# EAGLE design VU Meter 1inchx3inches V1.0 (EAGLE 7.1.0)
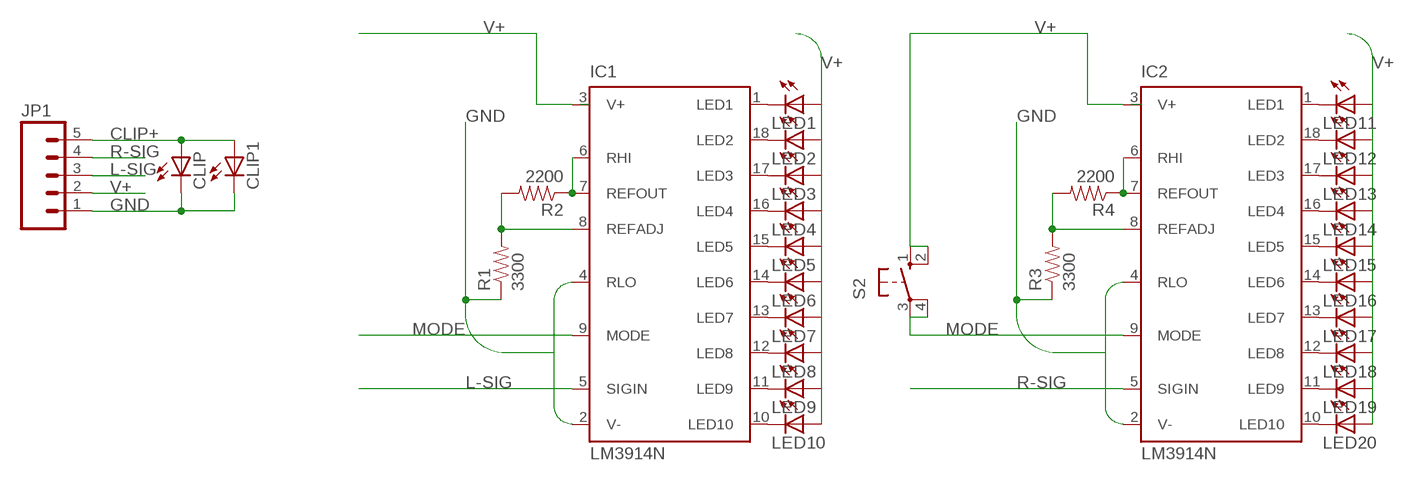
[diagram p0: schematic, sheet 1]

## Parts
CLIP  LED5MM  [LED5MM]
CLIP1  LED5MM  [LED5MM]
IC1  LM3914N  [DIL18]
IC2  LM3914N  [DIL18]
JP1  M05SMD2  [1X05-1MM-RA]
LED1  LED5MM  [LED5MM]
LED2  LED5MM  [LED5MM]
LED3  LED5MM  [LED5MM]
LED4  LED5MM  [LED5MM]
LED5  LED5MM  [LED5MM]
LED6  LED5MM  [LED5MM]
LED7  LED5MM  [LED5MM]
LED8  LED5MM  [LED5MM]
LED9  LED5MM  [LED5MM]
LED10  LED5MM  [LED5MM]
LED11  LED5MM  [LED5MM]
LED12  LED5MM  [LED5MM]
LED13  LED5MM  [LED5MM]
LED14  LED5MM  [LED5MM]
LED15  LED5MM  [LED5MM]
LED16  LED5MM  [LED5MM]
LED17  LED5MM  [LED5MM]
LED18  LED5MM  [LED5MM]
LED19  LED5MM  [LED5MM]
LED20  LED5MM  [LED5MM]
R1  3300  RESISTORPTH-1/4W  [AXIAL-0.4]
R2  2200  RESISTORPTH-1/4W  [AXIAL-0.4]
R3  3300  RESISTORPTH-1/4W  [AXIAL-0.4]
R4  2200  RESISTORPTH-1/4W  [AXIAL-0.4]
S2  10-XX  [B3F-10XX]

## Nets
CLIP+: CLIP1.A CLIP.A JP1.5
GND: CLIP1.K(C) CLIP.K(C) IC1.2(V-) IC1.4(RLO) IC2.2(V-) IC2.4(RLO) JP1.1 R1.P$1 R3.P$1
L-SIG: IC1.5(SIGIN) JP1.3
MODE: IC1.9(MODE) IC2.9(MODE) S2.3(P) S2.4(P1)
N$1: IC1.1(LED1) LED1.K(C)
N$2: IC1.6(RHI) IC1.7(REFOUT) R2.P$1
N$3: IC1.18(LED2) LED2.K(C)
N$4: IC1.17(LED3) LED3.K(C)
N$5: IC1.16(LED4) LED4.K(C)
N$6: IC1.15(LED5) LED5.K(C)
N$7: IC1.14(LED6) LED6.K(C)
N$8: IC1.13(LED7) LED7.K(C)
N$9: IC1.12(LED8) LED8.K(C)
N$10: IC1.11(LED9) LED9.K(C)
N$11: IC1.10(LED10) LED10.K(C)
N$13: IC1.8(REFADJ) R1.P$2 R2.P$2
N$14: IC2.6(RHI) IC2.7(REFOUT) R4.P$1
N$16: IC2.1(LED1) LED11.K(C)
N$17: IC2.18(LED2) LED12.K(C)
N$18: IC2.17(LED3) LED13.K(C)
N$19: IC2.16(LED4) LED14.K(C)
N$20: IC2.15(LED5) LED15.K(C)
N$21: IC2.14(LED6) LED16.K(C)
N$23: IC2.13(LED7) LED17.K(C)
N$24: IC2.12(LED8) LED18.K(C)
N$25: IC2.11(LED9) LED19.K(C)
N$26: IC2.10(LED10) LED20.K(C)
N$27: IC2.8(REFADJ) R3.P$2 R4.P$2
R-SIG: IC2.5(SIGIN) JP1.4
V+: IC1.3(V+) IC2.3(V+) JP1.2 LED1.A LED2.A LED3.A LED4.A LED5.A LED6.A LED7.A LED8.A LED9.A LED10.A LED11.A LED12.A LED13.A LED14.A LED15.A LED16.A LED17.A LED18.A LED19.A LED20.A S2.1(S) S2.2(S1)

## Library data of the parts
CLIP CLIP1 LED1-LED20 = led:LED: LED OSRAM: - CHIPLED LG R971, LG N971, LY N971, LG Q971, LY Q971, LO R971, LY R971 LH N974, LH R974 LS Q976, LO Q976, LY Q976 LO Q996 - Hyper CHIPLED LW Q18S LB Q993, LB Q99A, LB R99A - SideLED LS A670, LO A670, LY A670, LG A670, LP A670 LB A673, LV A673, LT A673, LW A673 LH A674 LY A675 LS A676, LA A676, LO A676, LY A676, LW A676 LS A679, LY A679, LG A679 - Hyper Micro SIDELED® LS Y876, LA Y876, LO Y876, LY Y876 LT Y87S - SmartLED LW L88C, LW L88S LB L89C, LB L89S, LG L890 LS L89K, LO L89K, LY L89K LS L896, LA L896, LO L896, LY L896 - TOPLED LS T670, LO T670, LY T670, LG T670, LP T670 LSG T670, LSP T670, LSY T670, LOP T670, LYG T670 LG T671, LOG T671, LSG T671 LB T673, LV T673, LT T673, LW T673 LH T674 LS T676, LA T676, LO T676, LY T676, LB T676, LH T676, LSB T676, LW T676 LB T67C, LV T67C, LT T67C, LS T67K, LO T67K, LY T67K, LW E67C LS E67B, LA E67B, LO E67B, LY E67B, LB E67C, LV E67C, LT E67C LW T67C LS T679, LY T679, LG T679 LS T770, LO T770, LY T770, LG T770, LP T770 LB T773, LV T773, LT T773, LW T773 LH T774 LS E675, LA E675, LY E675, LS T675 LS T776, LA T776, LO T776, LY T776, LB T776 LHGB T686 LT T68C, LB T68C - Hyper Mini TOPLED® LB M676 - Mini TOPLED Santana® LG M470 LS M47K, LO M47K, LY M47K Source: http://www.osram.convergy.de LUXEON: - LUMILED® LXK2-PW12-R00, LXK2-PW12-S00, LXK2-PW14-U00, LXK2-PW14-V00 LXK2-PM12-R00, LXK2-PM12-S00, LXK2-PM14-U00 LXK2-PE12-Q00, LXK2-PE12-R00, LXK2-PE12-S00, LXK2-PE14-T00, LXK2-PE14-U00 LXK2-PB12-K00, LXK2-PB12-L00, LXK2-PB12-M00, LXK2-PB14-N00, LXK2-PB14-P00, LXK2-PB14-Q00 LXK2-PR12-L00, LXK2-PR12-M00, LXK2-PR14-Q00, LXK2-PR14-R00 LXK2-PD12-Q00, LXK2-PD12-R00, LXK2-PD12-S00 LXK2-PH12-R00, LXK2-PH12-S00 LXK2-PL12-P00, LXK2-PL12-Q00, LXK2-PL12-R00 Source: www.luxeon.com KINGBRIGHT: KA-3528ASYC Source: www.kingbright.com
IC1 IC2 = national-semiconductor:LM391: Dot/Bar Display Driver Source: Data sheet LM3915 <http://www.national.com/ds/LM/LM3915.pdf> Data sheet LM3914 <http://www.national.com/ds/LM/LM3914.pdf>
JP1 = SparkFun-Connectors:M05: Header 5 Standard 5-pin 0.1" header. Use with straight break away headers (SKU : PRT-00116), right angle break away headers (PRT-00553), swiss pins (PRT-00743), machine pins (PRT-00117), and female headers (PRT-00115). Molex polarized connector foot print use with SKU : PRT-08230 with associated crimp pins and housings.
R1-R4 = SparkFun-Resistors:RESISTOR: Resistor Basic schematic elements and footprints for 0603, 1206, and PTH resistors.
S2 = switch-omron:10-XX: OMRON SWITCH; MPN: B3F-1000; OC_FARNELL: 176432; OC_NEWARK: 36M3542

## Board
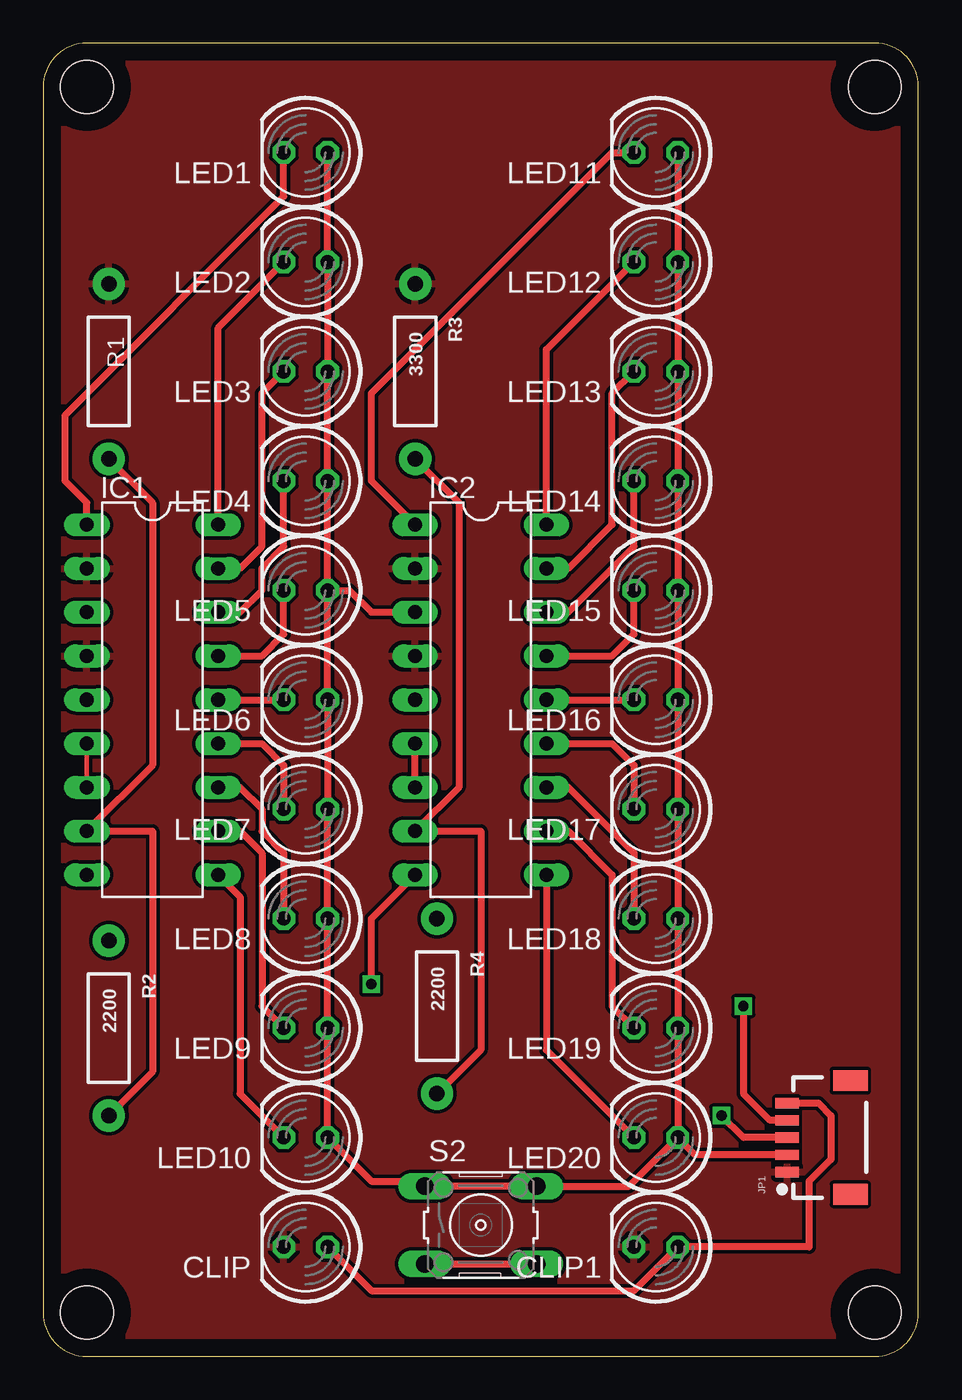
[diagram p1: board, top side]
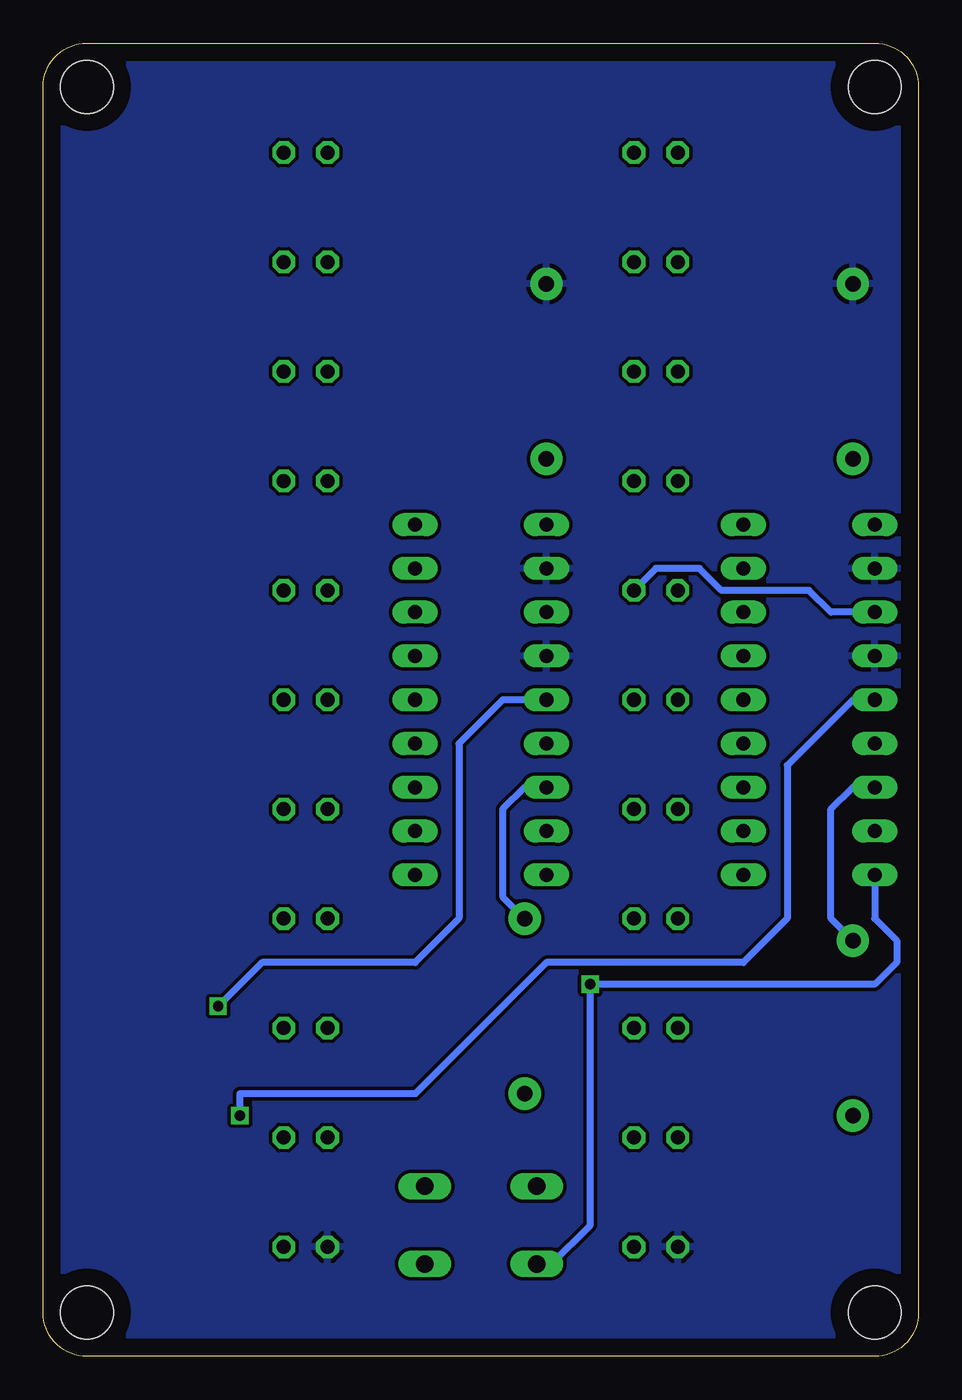
[diagram p2: board, bottom side, seen from below]

Size 50.8 x 76.2 mm. Coordinates in mm from the lower left corner, seen from the top.
Outline: 48.26,76.2 2.54,76.2 arc90 0,73.66 0,2.54 arc90 2.54,0 48.26,0 arc90 50.8,2.54 50.8,73.66 arc90 48.26,76.2
Copper layers (1*16): Top 0.035mm / dielectric 1.5mm / Bottom 0.035mm
Design rules "default": minimum track width 10mil, minimum drill 24mil, track to track 8mil, track to pad 8mil, pad to pad 8mil, via to via 8mil, smd to smd 8mil, copper to edge 40mil, drill to drill 8mil, minimum pad ring 10mil, minimum via ring 8mil, stop-mask expansion 4mil, vias tented up to drill 0mil, thermal gap 10mil

### Footprints (pad centres in the part's own frame; a part is rotated, then mirrored left to right if it is on the bottom)
LED5MM = drill 0.813 octagon: A -1.27,0; K 1.27,0
DIL18 = drill 0.813 long: 1 -10.16,-3.81; 2 -7.62,-3.81; 3 -5.08,-3.81; 4 -2.54,-3.81; 5 0,-3.81; 6 2.54,-3.81; 7 5.08,-3.81; 8 7.62,-3.81; 9 10.16,-3.81; 10 10.16,3.81; 11 7.62,3.81; 12 5.08,3.81; 13 2.54,3.81; 14 0,3.81; 15 -2.54,3.81; 16 -5.08,3.81; 17 -7.62,3.81; 18 -10.16,3.81
1X05-1MM-RA = smd 0.6 x 1.35: 1 -2,0; 2 -1,0; 3 0,0; 4 1,0; 5 2,0 | smd 1.2 x 2: NC1 3.3,-3.675; NC2 -3.3,-3.675
AXIAL-0.4 = drill 0.9 pad 1.88: P$1 -5.08,0; P$2 5.08,0
B3F-10XX = drill 1.016 long: 1 -3.251,2.261; 2 3.251,2.261; 3 -3.251,-2.261; 4 3.251,-2.261
STAND-OFF-TIGHT = hole 3.048: 0,0

### Placement (x,y rotation side)
CLIP  15.24,6.35 180 top
CLIP1  35.56,6.35 180 top
IC1  6.35,38.1 270 top
IC2  25.4,38.1 270 top
JP1  43.18,12.7 90 top
LED1  15.24,69.85 180 top
LED2  15.24,63.5 180 top
LED3  15.24,57.15 180 top
LED4  15.24,50.8 180 top
LED5  15.24,44.45 180 top
LED6  15.24,38.1 180 top
LED7  15.24,31.75 180 top
LED8  15.24,25.4 180 top
LED9  15.24,19.05 180 top
LED10  15.24,12.7 180 top
LED11  35.56,69.85 180 top
LED12  35.56,63.5 180 top
LED13  35.56,57.15 180 top
LED14  35.56,50.8 180 top
LED15  35.56,44.45 180 top
LED16  35.56,38.1 180 top
LED17  35.56,31.75 180 top
LED18  35.56,25.4 180 top
LED19  35.56,19.05 180 top
LED20  35.56,12.7 180 top
R1  3.81,57.15 270 top
R2  3.81,19.05 270 top
R3  21.59,57.15 270 top
R4  22.86,20.32 270 top
S2  25.4,7.62 0 top
U$1  [STAND-OFF-TIGHT]  48.26,73.66 0 top
U$2  [STAND-OFF-TIGHT]  48.26,2.54 0 top
U$3  [STAND-OFF-TIGHT]  2.54,73.66 0 top
U$4  [STAND-OFF-TIGHT]  2.54,2.54 0 top

### Tracks (layer width: path | path; a pad name or v marks a point on that pad's centre or on a via)
CLIP+
  Top 0.406: JP1.5 44.99,14.7 45.72,13.97 45.72,11.43 44.45,10.16 44.45,6.35 CLIP1.A 34.29,3.81 19.05,3.81 CLIP.A
GND
  pour Bottom: 0,76.2 50.8,76.2 50.8,0 0,0
  pour Top: 0,76.2 50.8,76.2 50.8,0 0,0
L-SIG  (via drill 0.6)
  Top 0.406: JP1.3 40.64,12.7 v39.37,13.97
  Bottom 0.406: IC1.5 3.81,38.1 7.62,34.29 7.62,25.4 10.16,22.86 21.59,22.86 29.21,15.24 39.37,15.24 v39.37,13.97
MODE  (via drill 0.6)
  Top 0.406: S2.3 S2.4 | v19.05,21.59 19.05,25.4 IC2.9
  Bottom 0.406: IC1.9 2.54,25.4 1.27,24.13 1.27,22.86 2.54,21.59 v19.05,21.59 19.05,7.62 21.31,5.36 S2.3
N$1
  Top 0.406: IC1.1 2.54,49.53 1.27,50.8 1.27,54.61 13.97,67.31 LED1.K
N$2
  Top 0.254: IC1.6 IC1.7
  Bottom 0.406: R2.P$1 5.08,25.4 5.08,31.75 3.81,33.02 IC1.7
N$3
  Top 0.406: IC1.18 10.16,59.69 LED2.K
N$4
  Top 0.406: IC1.17 11.43,45.72 12.7,46.99 12.7,55.88 LED3.K
N$5
  Top 0.406: IC1.16 11.43,43.18 12.7,44.45 12.7,45.72 13.97,46.99 LED4.K
N$6
  Top 0.406: IC1.15 12.7,40.64 13.97,41.91 LED5.K
N$7
  Top 0.406: IC1.14 LED6.K
N$8
  Top 0.406: IC1.13 12.7,35.56 13.97,34.29 LED7.K
N$9
  Top 0.406: IC1.12 11.43,33.02 12.7,31.75 12.7,30.48 13.97,29.21 LED8.K
N$10
  Top 0.406: LED9.K 12.7,20.32 12.7,29.21 11.43,30.48 IC1.11
N$11
  Top 0.406: IC1.10 11.43,26.67 11.43,15.24 LED10.K
N$13  (via drill 0.6)
  Top 0.406: R1.P$2 6.35,49.53 6.35,34.29 IC1.8 6.35,30.48 6.35,16.51 R2.P$2
  other vias: 3.81,52.07
N$14
  Top 0.406: IC2.7 IC2.6
  Bottom 0.406: IC2.7 22.86,33.02 24.13,31.75 24.13,26.67 R4.P$1
N$16
  Top 0.406: IC2.1 19.05,50.8 19.05,55.88 33.02,69.85 LED11.K
N$17
  Top 0.406: IC2.18 29.21,58.42 LED12.K
N$18
  Top 0.406: IC2.17 30.48,45.72 33.02,48.26 33.02,55.88 LED13.K
N$19
  Top 0.406: IC2.16 30.48,43.18 34.29,46.99 LED14.K
N$20
  Top 0.406: IC2.15 33.02,40.64 34.29,41.91 LED15.K
N$21
  Top 0.406: IC2.14 LED16.K
N$23
  Top 0.406: IC2.13 33.02,35.56 34.29,34.29 LED17.K
N$24
  Top 0.406: IC2.12 30.48,33.02 34.29,29.21 LED18.K
N$25
  Top 0.406: IC2.11 30.48,30.48 33.02,27.94 33.02,20.32 LED19.K
N$26
  Top 0.406: IC2.10 29.21,17.78 LED20.K
N$27
  Top 0.406: R3.P$2 24.13,49.53 24.13,33.02 IC2.8 25.4,30.48 25.4,17.78 R4.P$2
R-SIG  (via drill 0.6)
  Top 0.406: JP1.4 42.18,13.7 40.64,15.24 v40.64,20.32
  Bottom 0.406: IC2.5 24.13,38.1 26.67,35.56 26.67,25.4 29.21,22.86 38.1,22.86 v40.64,20.32
V+
  Top 0.406: LED11.A LED12.A LED13.A LED14.A LED15.A LED16.A LED17.A LED18.A LED19.A LED20.A | LED5.A LED6.A LED7.A LED8.A LED9.A LED10.A 19.05,10.16 21.87,10.16 S2.1 S2.2 34.01,9.88 LED20.A | LED5.A LED4.A LED3.A LED2.A LED1.A | LED5.A 17.78,44.45 19.05,43.18 IC2.3 | JP1.2 37.83,11.7 LED20.A
  Bottom 0.406: IC1.3 5.08,43.18 6.35,44.45 11.43,44.45 12.7,45.72 15.24,45.72 LED5.A